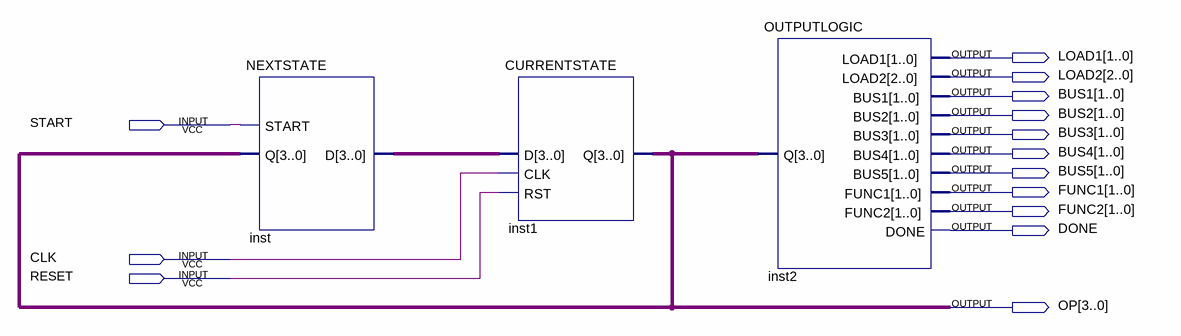
[diagram p0: schematic sheet]
// Quartus schematic Control.bdf as structural Verilog: 3 symbols, 14 pins
module Control (
  input  START,
  input  CLK,
  input  RESET,
  output [1:0] LOAD1,
  output [2:0] LOAD2,
  output [1:0] BUS1,
  output [1:0] BUS2,
  output [1:0] BUS3,
  output [1:0] BUS4,
  output [1:0] BUS5,
  output [1:0] FUNC1,
  output [1:0] FUNC2,
  output DONE,
  output [3:0] OP
);

  wire [3:0] inst_d;

  NEXTSTATE inst (.START(START), .Q(OP), .D(inst_d));
  CURRENTSTATE inst1 (.D(inst_d), .CLK(CLK), .RST(RESET), .Q(OP));
  OUTPUTLOGIC inst2 (
    .Q(OP), .LOAD1(LOAD1), .LOAD2(LOAD2), .BUS1(BUS1), .BUS2(BUS2), .BUS3(BUS3), .BUS4(BUS4), .BUS5(BUS5),
    .FUNC1(FUNC1), .FUNC2(FUNC2), .DONE(DONE));
endmodule
